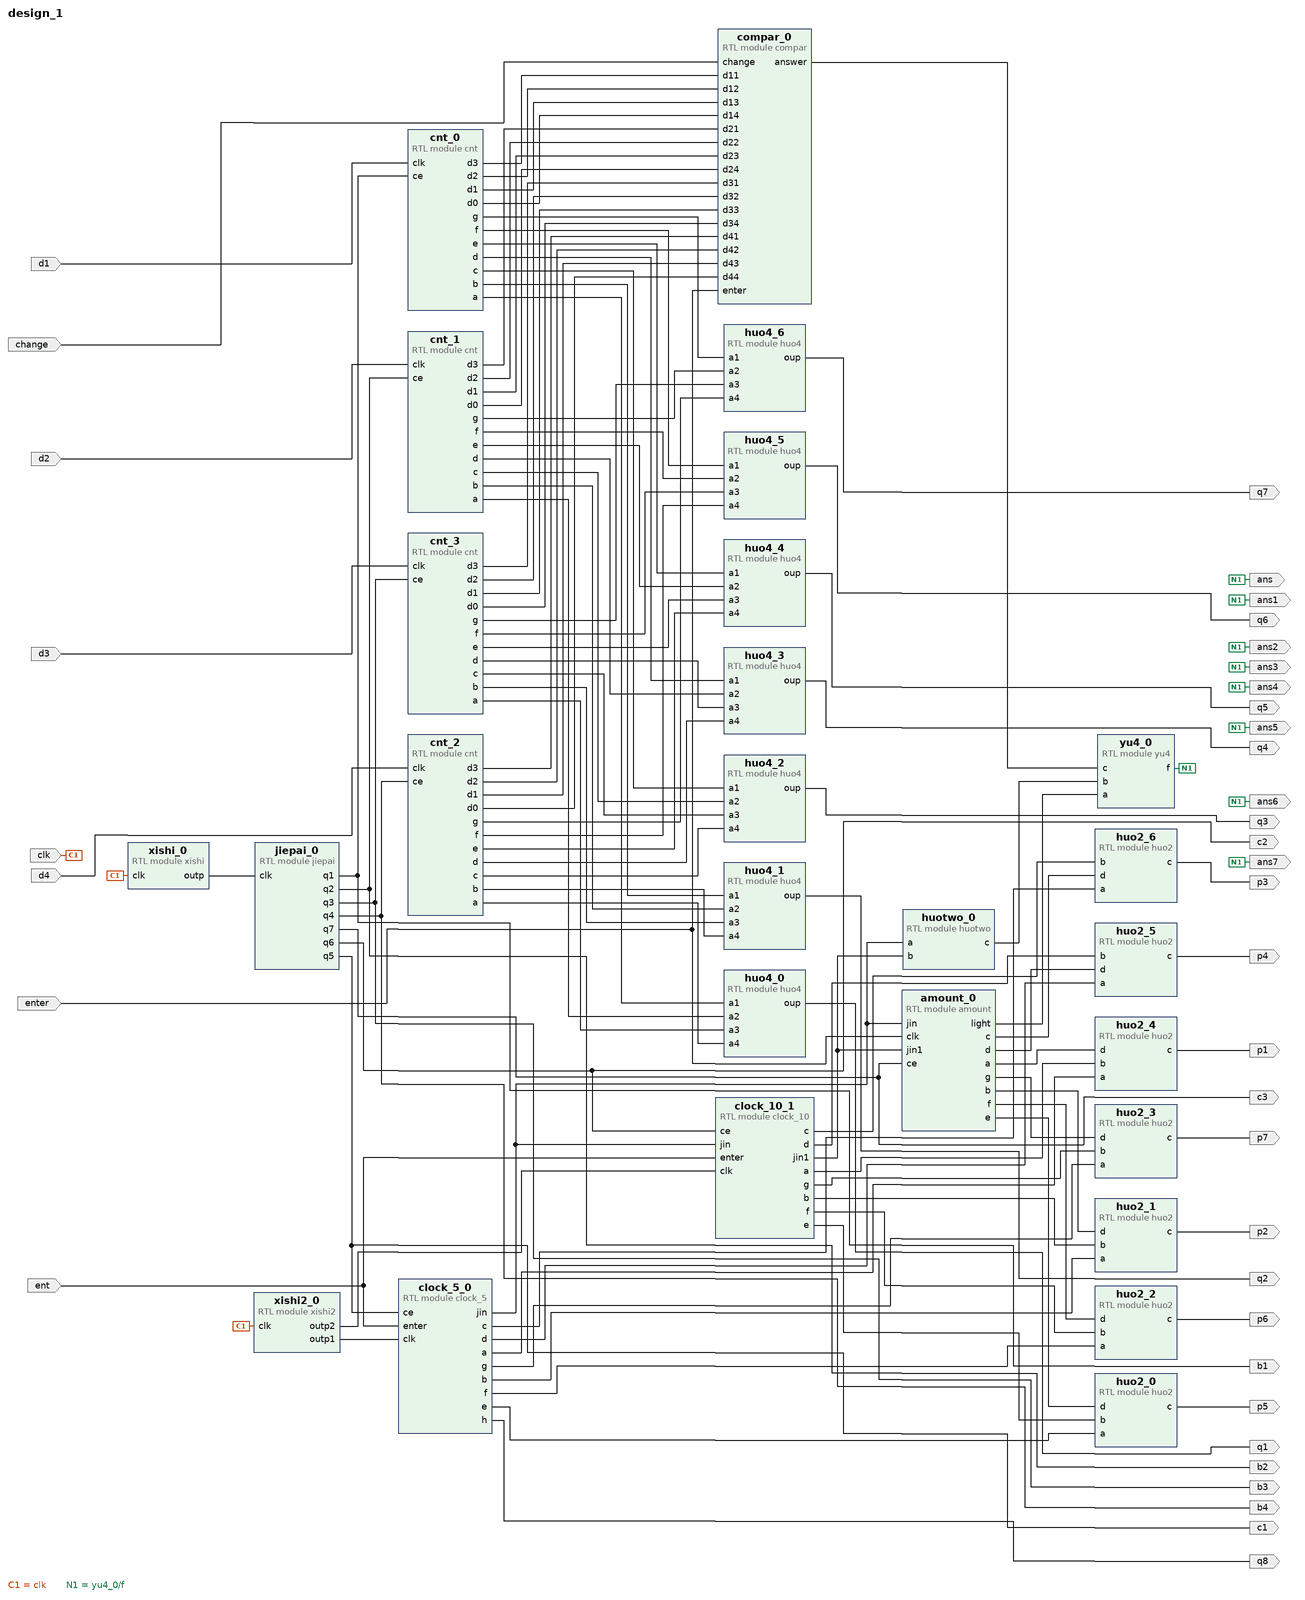
[diagram p0: block diagram of the top level]
# Vivado block design design_1, xc7a35tcsg324-3, Vivado 2018.1
create_bd_design design_1

create_bd_port -dir I d1
create_bd_port -dir I d2
create_bd_port -dir I d3
create_bd_port -dir I d4
create_bd_port -dir I clk
create_bd_port -dir O b1
create_bd_port -dir O b2
create_bd_port -dir O b3
create_bd_port -dir O b4
create_bd_port -dir O q1
create_bd_port -dir O q2
create_bd_port -dir O q3
create_bd_port -dir O q4
create_bd_port -dir O q5
create_bd_port -dir O q6
create_bd_port -dir O q7
create_bd_port -dir I change
create_bd_port -dir I enter
create_bd_port -dir I ent
create_bd_port -dir O c1
create_bd_port -dir O c2
create_bd_port -dir O p1
create_bd_port -dir O p2
create_bd_port -dir O p3
create_bd_port -dir O p4
create_bd_port -dir O p5
create_bd_port -dir O p6
create_bd_port -dir O p7
create_bd_port -dir O q8
create_bd_port -dir O c3
create_bd_port -dir O ans
create_bd_port -dir O ans1
create_bd_port -dir O ans2
create_bd_port -dir O ans3
create_bd_port -dir O ans4
create_bd_port -dir O ans5
create_bd_port -dir O ans6
create_bd_port -dir O ans7

create_bd_cell -type module -reference cnt cnt_0
create_bd_cell -type module -reference cnt cnt_1
create_bd_cell -type module -reference cnt cnt_2
create_bd_cell -type module -reference cnt cnt_3
create_bd_cell -type module -reference xishi xishi_0
create_bd_cell -type module -reference huo4 huo4_0
create_bd_cell -type module -reference huo4 huo4_1
create_bd_cell -type module -reference huo4 huo4_2
create_bd_cell -type module -reference huo4 huo4_3
create_bd_cell -type module -reference huo4 huo4_4
create_bd_cell -type module -reference huo4 huo4_5
create_bd_cell -type module -reference huo4 huo4_6
create_bd_cell -type module -reference compar compar_0
create_bd_cell -type module -reference jiepai jiepai_0
create_bd_cell -type module -reference huo2 huo2_0
create_bd_cell -type module -reference huo2 huo2_1
create_bd_cell -type module -reference huo2 huo2_2
create_bd_cell -type module -reference huo2 huo2_3
create_bd_cell -type module -reference huo2 huo2_4
create_bd_cell -type module -reference huo2 huo2_5
create_bd_cell -type module -reference huo2 huo2_6
create_bd_cell -type module -reference xishi2 xishi2_0
create_bd_cell -type module -reference clock_5 clock_5_0
create_bd_cell -type module -reference clock_10 clock_10_1
create_bd_cell -type module -reference amount amount_0
create_bd_cell -type module -reference huotwo huotwo_0
create_bd_cell -type module -reference yu4 yu4_0

# ---- connections ----

connect_bd_net -net d1_1 [get_bd_ports d1] [get_bd_pins cnt_0/clk]
connect_bd_net -net d2_1 [get_bd_ports d2] [get_bd_pins cnt_1/clk]
connect_bd_net -net d3_1 [get_bd_ports d3] [get_bd_pins cnt_3/clk]
connect_bd_net -net d4_1 [get_bd_ports d4] [get_bd_pins cnt_2/clk]
connect_bd_net [get_bd_ports clk] [get_bd_pins xishi_0/clk] [get_bd_pins xishi2_0/clk]
connect_bd_net [get_bd_pins xishi_0/outp] [get_bd_pins jiepai_0/clk]
connect_bd_net [get_bd_pins jiepai_0/q1] [get_bd_ports b1] [get_bd_pins cnt_0/ce]
connect_bd_net [get_bd_pins jiepai_0/q2] [get_bd_ports b2] [get_bd_pins cnt_1/ce]
connect_bd_net [get_bd_pins jiepai_0/q3] [get_bd_ports b3] [get_bd_pins cnt_3/ce]
connect_bd_net [get_bd_pins jiepai_0/q4] [get_bd_ports b4] [get_bd_pins cnt_2/ce]
connect_bd_net [get_bd_pins cnt_0/a] [get_bd_pins huo4_0/a1]
connect_bd_net [get_bd_pins cnt_1/a] [get_bd_pins huo4_0/a2]
connect_bd_net [get_bd_pins cnt_3/a] [get_bd_pins huo4_0/a3]
connect_bd_net [get_bd_pins cnt_2/a] [get_bd_pins huo4_0/a4]
connect_bd_net [get_bd_pins huo4_0/oup] [get_bd_ports q1]
connect_bd_net [get_bd_pins cnt_0/b] [get_bd_pins huo4_1/a1]
connect_bd_net [get_bd_pins cnt_1/b] [get_bd_pins huo4_1/a2]
connect_bd_net [get_bd_pins cnt_3/b] [get_bd_pins huo4_1/a3]
connect_bd_net [get_bd_pins cnt_2/b] [get_bd_pins huo4_1/a4]
connect_bd_net [get_bd_pins huo4_1/oup] [get_bd_ports q2]
connect_bd_net [get_bd_pins cnt_0/c] [get_bd_pins huo4_2/a1]
connect_bd_net [get_bd_pins cnt_1/c] [get_bd_pins huo4_2/a2]
connect_bd_net [get_bd_pins cnt_3/c] [get_bd_pins huo4_2/a3]
connect_bd_net [get_bd_pins cnt_2/c] [get_bd_pins huo4_2/a4]
connect_bd_net [get_bd_pins huo4_2/oup] [get_bd_ports q3]
connect_bd_net [get_bd_pins cnt_0/d] [get_bd_pins huo4_3/a1]
connect_bd_net [get_bd_pins cnt_1/d] [get_bd_pins huo4_3/a2]
connect_bd_net [get_bd_pins cnt_3/d] [get_bd_pins huo4_3/a3]
connect_bd_net [get_bd_pins cnt_2/d] [get_bd_pins huo4_3/a4]
connect_bd_net [get_bd_pins huo4_3/oup] [get_bd_ports q4]
connect_bd_net [get_bd_pins cnt_0/e] [get_bd_pins huo4_4/a1]
connect_bd_net [get_bd_pins cnt_1/e] [get_bd_pins huo4_4/a2]
connect_bd_net [get_bd_pins cnt_3/e] [get_bd_pins huo4_4/a3]
connect_bd_net [get_bd_pins cnt_2/e] [get_bd_pins huo4_4/a4]
connect_bd_net [get_bd_pins huo4_4/oup] [get_bd_ports q5]
connect_bd_net [get_bd_pins cnt_0/f] [get_bd_pins huo4_5/a1]
connect_bd_net [get_bd_pins cnt_1/f] [get_bd_pins huo4_5/a2]
connect_bd_net [get_bd_pins cnt_3/f] [get_bd_pins huo4_5/a3]
connect_bd_net [get_bd_pins cnt_2/f] [get_bd_pins huo4_5/a4]
connect_bd_net [get_bd_pins huo4_5/oup] [get_bd_ports q6]
connect_bd_net [get_bd_pins cnt_0/g] [get_bd_pins huo4_6/a1]
connect_bd_net [get_bd_pins cnt_1/g] [get_bd_pins huo4_6/a2]
connect_bd_net [get_bd_pins cnt_3/g] [get_bd_pins huo4_6/a3]
connect_bd_net [get_bd_pins cnt_2/g] [get_bd_pins huo4_6/a4]
connect_bd_net [get_bd_pins huo4_6/oup] [get_bd_ports q7]
connect_bd_net [get_bd_pins cnt_0/d3] [get_bd_pins compar_0/d11]
connect_bd_net [get_bd_pins cnt_0/d2] [get_bd_pins compar_0/d12]
connect_bd_net [get_bd_pins cnt_0/d1] [get_bd_pins compar_0/d13]
connect_bd_net [get_bd_pins cnt_0/d0] [get_bd_pins compar_0/d14]
connect_bd_net [get_bd_pins cnt_1/d3] [get_bd_pins compar_0/d21]
connect_bd_net [get_bd_pins cnt_1/d2] [get_bd_pins compar_0/d22]
connect_bd_net [get_bd_pins cnt_1/d1] [get_bd_pins compar_0/d23]
connect_bd_net [get_bd_pins cnt_1/d0] [get_bd_pins compar_0/d24]
connect_bd_net [get_bd_pins cnt_3/d3] [get_bd_pins compar_0/d31]
connect_bd_net [get_bd_pins cnt_3/d2] [get_bd_pins compar_0/d32]
connect_bd_net [get_bd_pins cnt_3/d1] [get_bd_pins compar_0/d33]
connect_bd_net [get_bd_pins cnt_3/d0] [get_bd_pins compar_0/d34]
connect_bd_net [get_bd_pins cnt_2/d3] [get_bd_pins compar_0/d41]
connect_bd_net [get_bd_pins cnt_2/d2] [get_bd_pins compar_0/d42]
connect_bd_net [get_bd_pins cnt_2/d1] [get_bd_pins compar_0/d43]
connect_bd_net [get_bd_pins cnt_2/d0] [get_bd_pins compar_0/d44]
connect_bd_net [get_bd_ports change] [get_bd_pins compar_0/change]
connect_bd_net [get_bd_ports enter] [get_bd_pins compar_0/enter] [get_bd_pins amount_0/clk]
connect_bd_net [get_bd_pins xishi2_0/outp1] [get_bd_pins clock_5_0/clk]
connect_bd_net [get_bd_pins xishi2_0/outp2] [get_bd_pins clock_10_1/clk]
connect_bd_net [get_bd_ports ent] [get_bd_pins clock_5_0/enter] [get_bd_pins clock_10_1/enter]
connect_bd_net [get_bd_pins clock_5_0/a] [get_bd_pins huo2_4/a]
connect_bd_net [get_bd_pins clock_10_1/a] [get_bd_pins huo2_4/b]
connect_bd_net [get_bd_pins jiepai_0/q5] [get_bd_ports c1] [get_bd_pins clock_5_0/ce]
connect_bd_net [get_bd_pins jiepai_0/q6] [get_bd_ports c2] [get_bd_pins clock_10_1/ce]
connect_bd_net [get_bd_pins clock_5_0/b] [get_bd_pins huo2_1/a]
connect_bd_net [get_bd_pins clock_10_1/b] [get_bd_pins huo2_1/b]
connect_bd_net [get_bd_pins clock_5_0/c] [get_bd_pins huo2_6/a]
connect_bd_net [get_bd_pins clock_10_1/c] [get_bd_pins huo2_6/b]
connect_bd_net [get_bd_pins clock_10_1/d] [get_bd_pins huo2_5/b]
connect_bd_net [get_bd_pins clock_5_0/d] [get_bd_pins huo2_5/a]
connect_bd_net [get_bd_pins clock_5_0/e] [get_bd_pins huo2_0/a]
connect_bd_net [get_bd_pins clock_10_1/e] [get_bd_pins huo2_0/b]
connect_bd_net [get_bd_pins clock_5_0/f] [get_bd_pins huo2_2/a]
connect_bd_net [get_bd_pins clock_10_1/f] [get_bd_pins huo2_2/b]
connect_bd_net [get_bd_pins clock_5_0/g] [get_bd_pins huo2_3/a]
connect_bd_net [get_bd_pins clock_10_1/g] [get_bd_pins huo2_3/b]
connect_bd_net [get_bd_pins huo2_4/c] [get_bd_ports p1]
connect_bd_net [get_bd_pins huo2_1/c] [get_bd_ports p2]
connect_bd_net [get_bd_pins huo2_6/c] [get_bd_ports p3]
connect_bd_net [get_bd_pins huo2_5/c] [get_bd_ports p4]
connect_bd_net [get_bd_pins huo2_0/c] [get_bd_ports p5]
connect_bd_net [get_bd_pins huo2_2/c] [get_bd_ports p6]
connect_bd_net [get_bd_pins huo2_3/c] [get_bd_ports p7]
connect_bd_net [get_bd_pins clock_5_0/h] [get_bd_ports q8]
connect_bd_net [get_bd_pins amount_0/a] [get_bd_pins huo2_4/d]
connect_bd_net [get_bd_pins amount_0/b] [get_bd_pins huo2_1/d]
connect_bd_net [get_bd_pins amount_0/c] [get_bd_pins huo2_6/d]
connect_bd_net [get_bd_pins amount_0/d] [get_bd_pins huo2_5/d]
connect_bd_net [get_bd_pins amount_0/e] [get_bd_pins huo2_0/d]
connect_bd_net [get_bd_pins amount_0/f] [get_bd_pins huo2_2/d]
connect_bd_net [get_bd_pins amount_0/g] [get_bd_pins huo2_3/d]
connect_bd_net [get_bd_pins jiepai_0/q7] [get_bd_ports c3] [get_bd_pins amount_0/ce]
# net clock_5_0_jin has one end: 
# net clock_10_1_jin1 has one end: 
connect_bd_net [get_bd_pins huotwo_0/c] [get_bd_pins yu4_0/b]
connect_bd_net [get_bd_pins clock_5_0/jin] [get_bd_pins clock_10_1/jin] [get_bd_pins amount_0/jin] [get_bd_pins huotwo_0/a]
connect_bd_net [get_bd_pins clock_10_1/jin1] [get_bd_pins amount_0/jin1] [get_bd_pins huotwo_0/b]
connect_bd_net [get_bd_pins amount_0/light] [get_bd_pins yu4_0/a]
connect_bd_net [get_bd_pins compar_0/answer] [get_bd_pins yu4_0/c]
connect_bd_net [get_bd_pins yu4_0/f] \
  [get_bd_ports ans1] [get_bd_ports ans7] [get_bd_ports ans] [get_bd_ports ans4] [get_bd_ports ans5] [get_bd_ports ans6] \
  [get_bd_ports ans2] [get_bd_ports ans3]

validate_bd_design
save_bd_design
